# EAGLE schematic RTS_Hub_V1.2 (EAGLE 9.5.0)
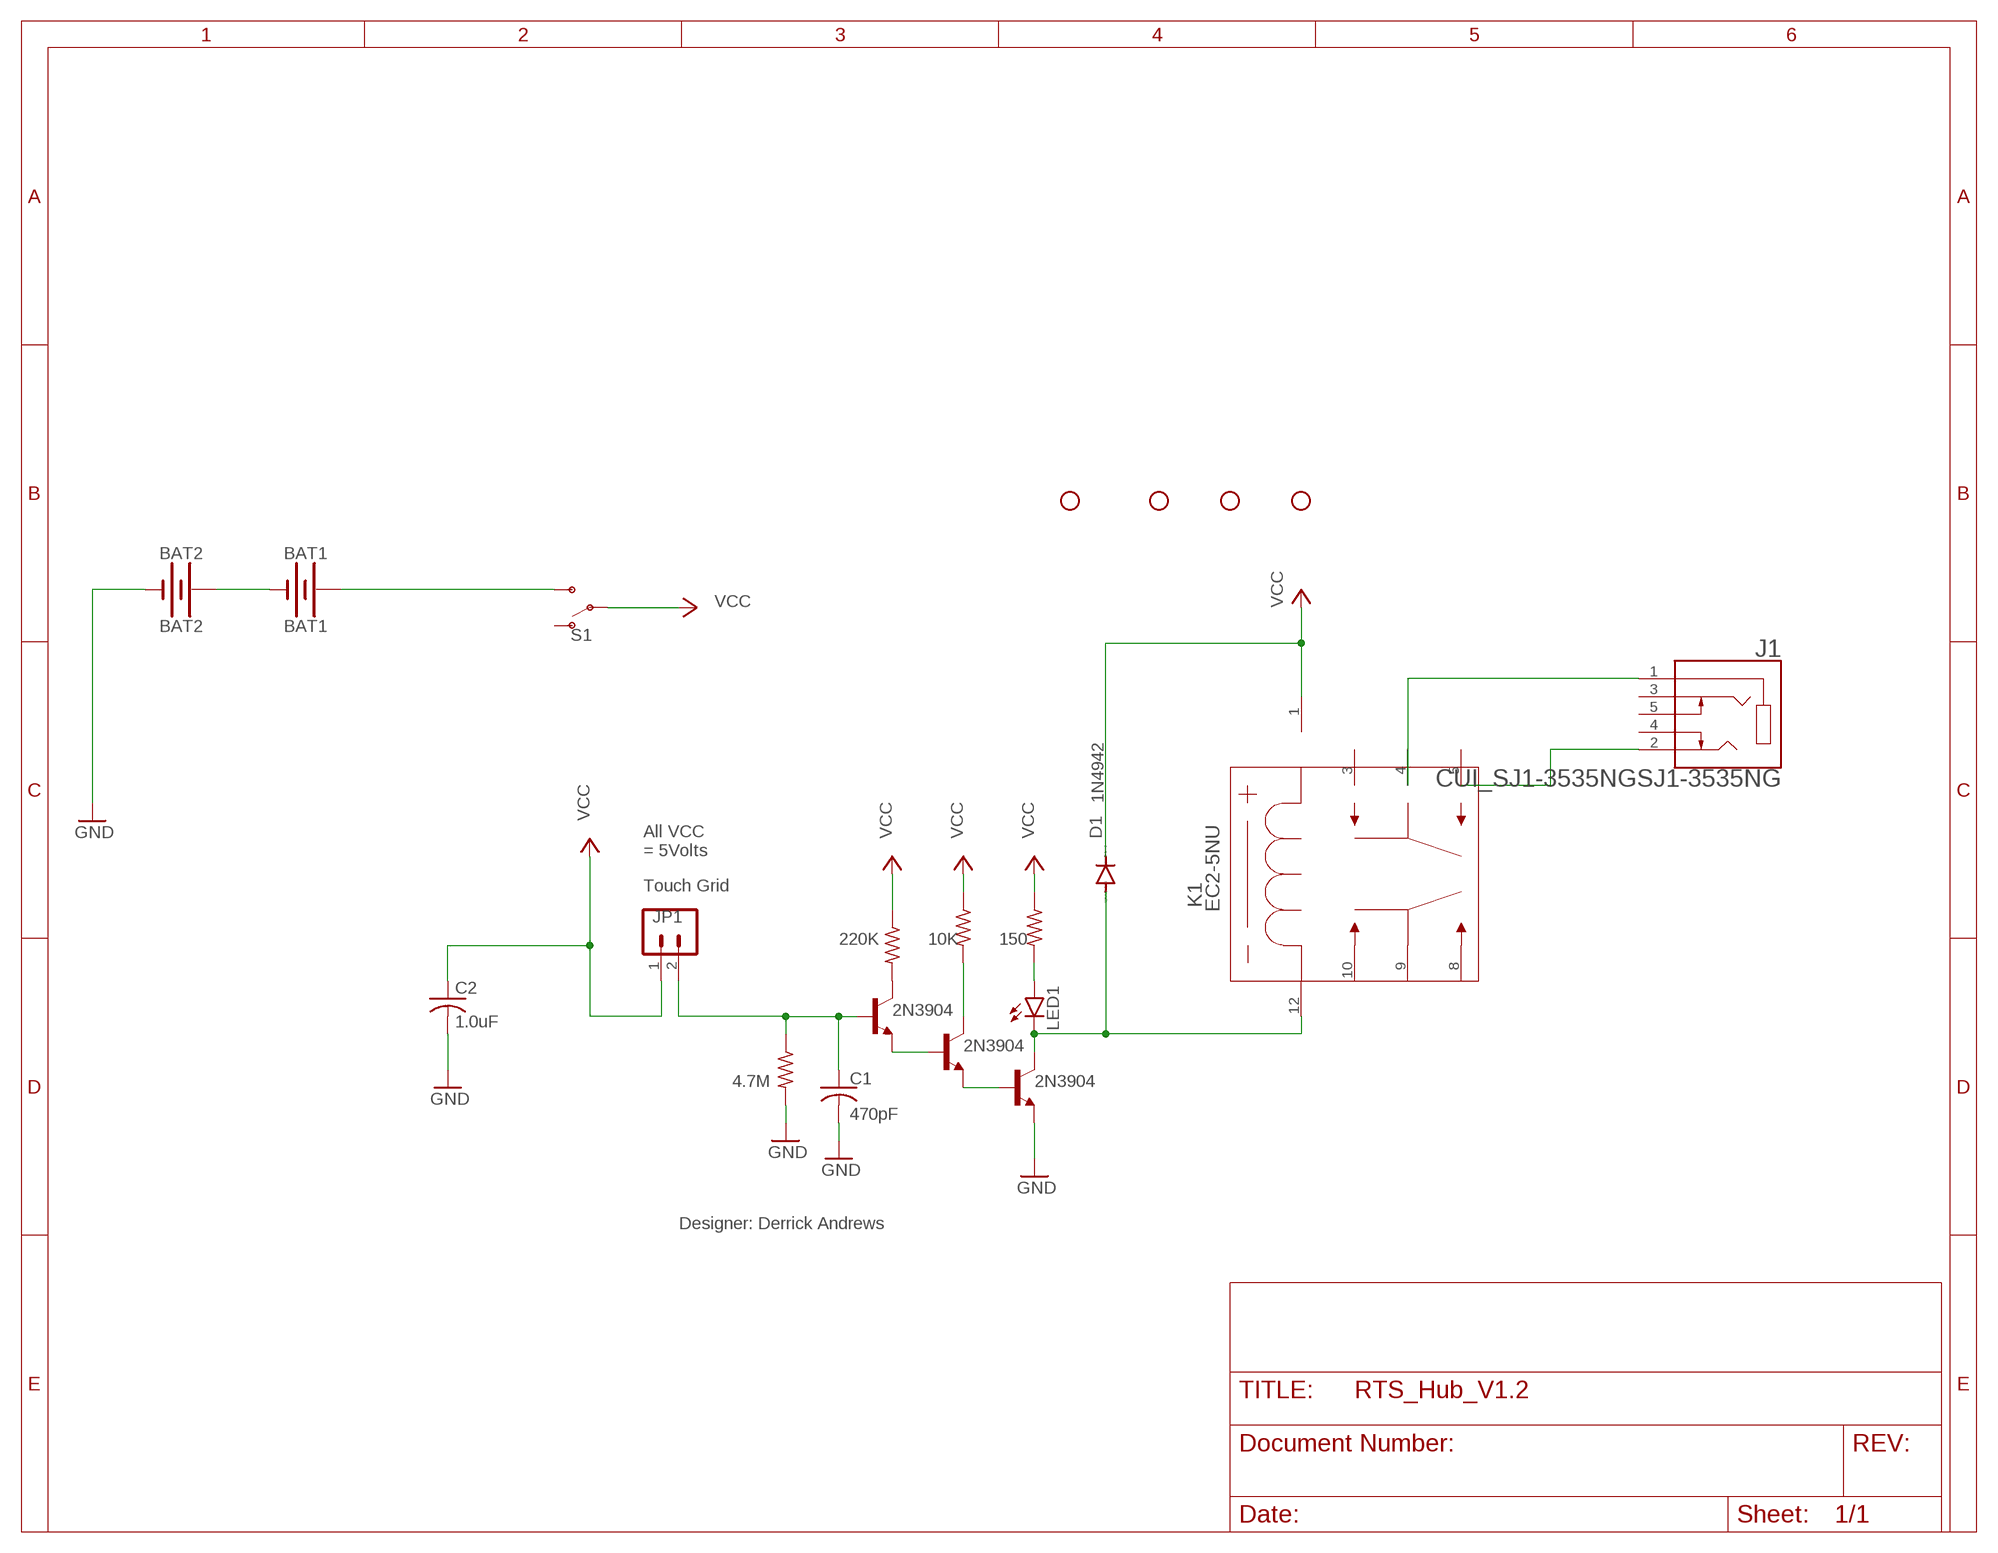
[diagram p0: schematic, sheet 1]

## Parts
BAT1  BAT1  BATTERY-20MM_PTH  [BATTCOM_20MM_PTH]
BAT2  BAT2  BATTERY-20MM_PTH  [BATTCOM_20MM_PTH]
C1  470pF  CAPACITOR-US-025  [C025-030X050]
C2  1.0uF  CAPACITOR-US-050  [C050-030X075]
D1  1N4942  DIODE-DO41  [DO41-10]
H1  STAND-OFF-  [STAND-OFF]
H2  STAND-OFF-  [STAND-OFF]
H3  STAND-OFF-  [STAND-OFF]
H4  STAND-OFF-  [STAND-OFF]
J1  CUI_SJ1-3535NGSJ1-3535NG  [CUI_SJ1-3535NG]
JP1  HEADER_1X02-1X02  [1X02]
K1  EC2-5NU  [EC2NU]
LED1  LED5MM  [LED_5MM]
R1  10K  RESISTOR-US-0207/7  [RESISTOR_0207/7]
R2  4.7M  RESISTOR-US-0207/7  [RESISTOR_0207/7]
R3  220K  RESISTOR-US-0207/7  [RESISTOR_0207/7]
R4  150  RESISTOR-US-0207/7  [RESISTOR_0207/7]
S1  SWITCH-SPDT-PTH_11.6X4.0MM  [SWITCH_SPDT_PTH_11.6X4.0MM]
T1  2N3904  [TO92-CBE]
T2  2N3904  [TO92-CBE]
T3  2N3904  [TO92-CBE]

## Nets
GND: BAT2.- C1.2 C2.2 R2.2 T1.E
N$1: T2.B T3.E
N$2: T1.B T2.E
N$3: D1.A K1.12 LED1.K(C) T1.C
N$4: R1.2 T2.C
N$5: R3.2 T3.C
N$6: LED1.A R4.2
N$7: C1.1 JP1.2 R2.1 T3.B
N$9: BAT1.+ S1.3(S)
N$11: J1.1 K1.4
N$12: J1.2 K1.5
N$15: BAT1.- BAT2.+
VCC: C2.1 D1.C JP1.1 K1.1 R1.1 R3.1 R4.1 S1.2(P)
Unconnected: J1.3 J1.4 J1.5 K1.3 K1.8 K1.9 K1.10 S1.1(O)

## Notes on the sheet
- All VCC
  = 5Volts
- Touch Grid
- 220K | 10K | 150
- 4.7M
- Designer: Derrick Andrews

## Library data of the parts
BAT1 BAT2 = MMC Eagle:BATTERY-
C1 C2 = MMC Eagle:CAPACITOR-US-
D1 = MMC Eagle:DIODE-: DIODE 1.0 A, 200 V, 150 ns
H1-H4 = MMC Eagle:STAND-OFF-
J1 = MMC Eagle:CUI_SJ1-3535NG
JP1 = MMC Eagle:HEADER_1X02-
K1 = MMC Eagle:EC2-5NU; MANUFACTURER_PART_NUMBER: EC25NU; VENDOR: KEMET
LED1 = MMC Eagle:LED: LED (Generic) Standard schematic elements and footprints for 5mm, 3mm, 1206, and 0603 sized LEDs. Generic LEDs with no color specified.
R1-R4 = MMC Eagle:RESISTOR-US-: RESISTOR, American symbol
S1 = MMC Eagle:SWITCH-SPDT-
T1-T3 = MMC Eagle:2N3904